# EAGLE schematic sch-sections (EAGLE 5.11)
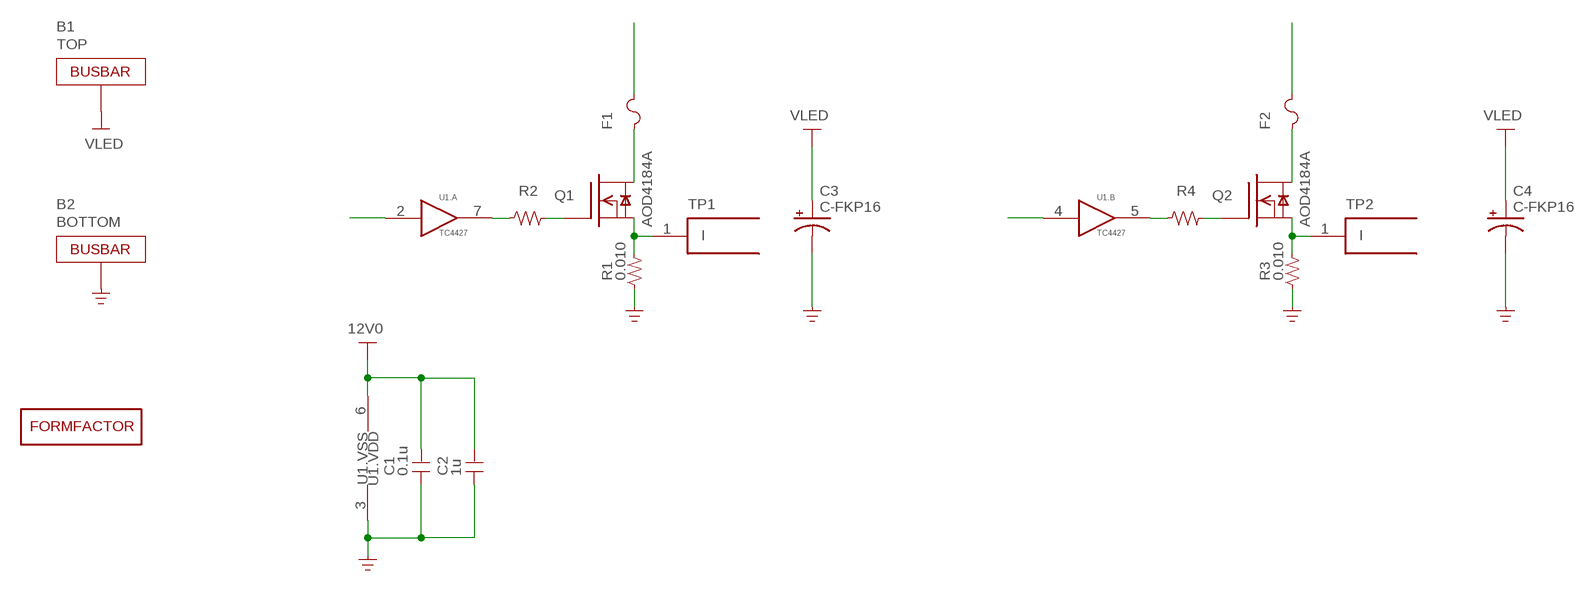
[diagram p0: schematic, sheet 1]

## Parts
B1  TOP  BUSBAR  [BUSBAR]
B2  BOTTOM  BUSBAR  [BUSBAR]
C1  0.1u  C-0603  [SMD0603]
C2  1u  C-0603  [SMD0603]
C3  C-FKP16  [EEV-FK-P16]
C4  C-FKP16  [EEV-FK-P16]
F1  FUSE-1206  [SMD1206]
F2  FUSE-1206  [SMD1206]
FORMFACTOR1  FORMFACTOR  [SINGLECHANNELSTROBE]
Q1  AOD4184A  [TO252]
Q2  AOD4184A  [TO252]
R1  0.010  R-3.2X1.6MM  [3.2X1.6MM]
R2  R-0603  [SMD0603]
R3  0.010  R-3.2X1.6MM  [3.2X1.6MM]
R4  R-0603  [SMD0603]
TP1  I  TP-HOLE  [TP-HOLE]
TP2  I  TP-HOLE  [TP-HOLE]
U1  TC4427  [SOIC8]

## Nets
12V0: C1.2 C2.2 U1.6(.VDD:VDD)
GND: B2.1 C1.1 C2.1 C3.1(-) C4.1(-) R1.1 R3.1 U1.3(.VSS:VSS)
N$1: Q1.R(S) R1.2 TP1.1
N$2: Q1.L(G) R2.2
N$3: R2.1 U1.7(.A:O)
N$4: U1.2(.A:I)
N$5: F1.1 Q1.M(D)
N$6: F1.2
N$7: Q2.R(S) R3.2 TP2.1
N$8: Q2.L(G) R4.2
N$9: R4.1 U1.5(.B:O)
N$10: F2.1 Q2.M(D)
N$11: F2.2
N$12: U1.4(.B:I)
VLED: B1.1 C3.2(+) C4.2(+)
Unconnected: U1.1(NC) U1.8(NC)

## Library data of the parts
B1 B2 = parts:BUSBAR
C1 C2 = parts:C
C3 C4 = parts:C-
F1 F2 = parts:FUSE
FORMFACTOR1 = parts:FORMFACTOR
Q1 Q2 = parts:AOD4184A
R1-R4 = parts:R
TP1 TP2 = parts:TP
U1 = parts:TC4427